# Altium project PCB_Project.PrjPcb
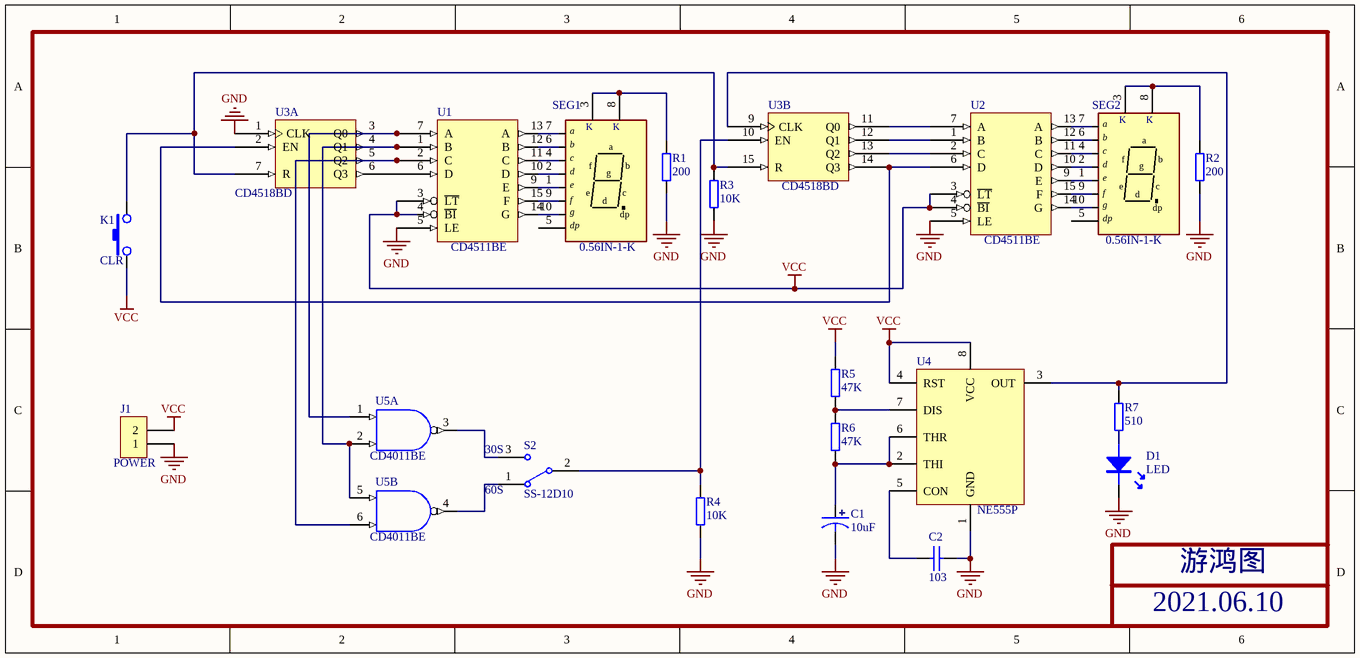
[diagram p0: 30s-60s计时器.SchDoc]
1 sheet, 20 parts. Net scope: global (net labels, ports and power ports of the same name join across sheets).
Board file: PCB.PcbDoc

## Sheet 30s-60s计时器.SchDoc
size 254 x 121 mm

### Parts
C1  10uF  [DIP-EC1.5X4X8]
C2  103  [RAD-0.2]
D1  LED  [LED3-RED]
J1  POWER  [CONN-TH_2P-P5.08_DB128L-5.08-2P]
K1  CLR  [DIP-6X6X6]
R1  200  [AXIAL0.4]
R2  200  [AXIAL0.4]
R3  10K  [AXIAL0.4]
R4  10K  [AXIAL0.4]
R5  47K  [AXIAL0.4]
R6  47K  [AXIAL0.4]
R7  510  [AXIAL0.4]
S2  SS-12D10  [Pin HDR1X3/2.54mm-S]
SEG1  0.56IN-1-K  [0.56IN-1P]
SEG2  0.56IN-1-K  [0.56IN-1P]
U1  CD4511BE  [DIP-16]
U2  CD4511BE  [DIP-16]
U3  CD4518BD  [DIP-16]  (parts A,B of 2)
U4  NE555P  [DIP8]
U5  CD4011BE  [DIP-14]  (parts A,B of 4)

### Nets
GND: C1.2 C2.2 D1.K J1.1 R1.2 R2.2 R3.1 R4.1 U1.5(LE) U1.8(GND) U2.5(LE) U2.8(GND) U3.1(CLK) U3.8(GND) U4.1(GND) U5.7(GND)
VCC: J1.2 K1.1 R5.2 U1.3(~{LT}) U1.4(~{BI}) U1.16(VCC) U2.3(~{LT}) U2.4(~{BI}) U2.16(VCC) U3.16(VCC) U4.4(RST) U4.8(VCC)
VDD: U5.14(VDD)
NetC1_1: C1.1 R6.1 U4.2(THI) U4.6(THR)
NetC2_1: C2.1 U4.5(CON)
NetD1_A: D1.A R7.1
NetK1_3: K1.3 R3.2 U3.7(R) U3.15(R)
NetR1_1: R1.1 SEG1.3(VCC) SEG1.8
NetR2_1: R2.1 SEG2.3(VCC) SEG2.8
NetR4_2: R4.2 S2.2 U3.10(EN)
NetR5_1: R5.1 R6.2 U4.7(DIS)
NetR7_2: R7.2 U3.9(CLK) U4.3(OUT)
NetS2_1: S2.1 U5.4(Y)
NetS2_3: S2.3 U5.3(Y)
NetSEG1_1: SEG1.1 U1.9(E)
NetSEG1_2: SEG1.2 U1.10(D)
NetSEG1_4: SEG1.4 U1.11(C)
NetSEG1_6: SEG1.6 U1.12(B)
NetSEG1_7: SEG1.7 U1.13(A)
NetSEG1_9: SEG1.9 U1.15(F)
NetSEG1_10: SEG1.10 U1.14(G)
NetSEG2_1: SEG2.1 U2.9(E)
NetSEG2_2: SEG2.2 U2.10(D)
NetSEG2_4: SEG2.4 U2.11(C)
NetSEG2_6: SEG2.6 U2.12(B)
NetSEG2_7: SEG2.7 U2.13(A)
NetSEG2_9: SEG2.9 U2.15(F)
NetSEG2_10: SEG2.10 U2.14(G)
NetU1_1: U1.1(B) U3.4(Q1) U5.2(B) U5.5(A)
NetU1_2: U1.2(C) U3.5(Q2) U5.6(B)
NetU1_6: U1.6(D) U3.6(Q3)
NetU1_7: U1.7(A) U3.3(Q0) U5.1(A)
NetU2_1: U2.1(B) U3.12(Q1)
NetU2_2: U2.2(C) U3.13(Q2)
NetU2_6: U2.6(D) U3.2(EN) U3.14(Q3)
NetU2_7: U2.7(A) U3.11(Q0)

Not connected (* = marked no-connect by the designer): SEG1 5; SEG2 5

### Notes on the sheet
- (near S2) 30S
- (near S2) 60S
- 游鸿图
- 2021.06.10
- (in symbol 0.56IN-1-K) K; a; b; c; f; d; g; e; dp

### Library data of the parts
C1 = DIP_ECAP: 直插电解电容
C2 = CAP: 无极性电容
J1 = Pin HDR1X2
K1 = KEY
R1-R7 = RES: 电阻
SEG1 SEG2 = 0.56IN-1-K: 1位0.56寸共阴数码管
U1 U2 = 4511
U3 = 4518
U4 = NE555
U5 = 4011: Quad 2-Input NAND Gate